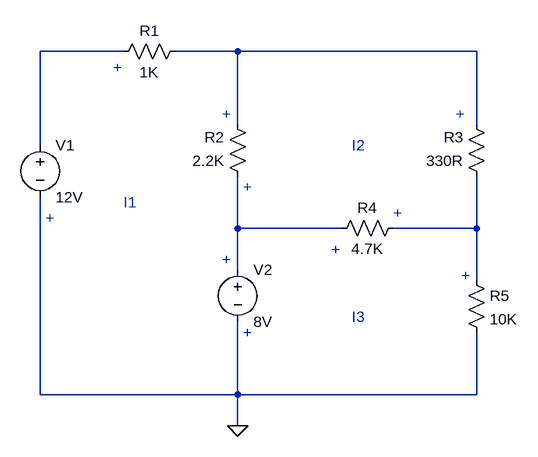
[diagram p0: schematic circuito1.asc]
circuito1.asc, the LTspice schematic file:
Version 4
SHEET 1 880 680
WIRE 64 -192 -64 -192
WIRE 240 -192 144 -192
WIRE 608 -192 240 -192
WIRE 240 -80 240 -192
WIRE 608 -80 608 -192
WIRE -64 -48 -64 -192
WIRE 240 80 240 0
WIRE 400 80 240 80
WIRE 608 80 608 0
WIRE 608 80 480 80
WIRE 240 144 240 80
WIRE 608 160 608 80
WIRE -64 336 -64 32
WIRE 240 336 240 224
WIRE 240 336 -64 336
WIRE 608 336 608 240
WIRE 608 336 240 336
WIRE 240 384 240 336
FLAG 240 384 0
SYMBOL voltage -64 -64 R0
WINDOW 123 0 0 Left 2
WINDOW 39 0 0 Left 2
SYMATTR InstName V1
SYMATTR Value 12V
SYMBOL res 160 -208 R90
WINDOW 0 0 56 VBottom 2
WINDOW 3 32 56 VTop 2
SYMATTR InstName R1
SYMATTR Value 1K
SYMBOL res 256 16 R180
WINDOW 0 36 76 Left 2
WINDOW 3 36 40 Left 2
SYMATTR InstName R2
SYMATTR Value 2.2K
SYMBOL res 624 16 R180
WINDOW 0 36 76 Left 2
WINDOW 3 36 40 Left 2
SYMATTR InstName R3
SYMATTR Value 330R
SYMBOL res 384 96 R270
WINDOW 0 32 56 VTop 2
WINDOW 3 0 56 VBottom 2
SYMATTR InstName R4
SYMATTR Value 4.7K
SYMBOL res 592 144 R0
SYMATTR InstName R5
SYMATTR Value 10K
SYMBOL voltage 240 128 R0
WINDOW 123 0 0 Left 2
WINDOW 39 0 0 Left 2
SYMATTR InstName V2
SYMATTR Value 8V
TEXT 64 40 Left 2 ;I1
TEXT 416 -48 Left 2 ;I2
TEXT 416 216 Left 2 ;I3
TEXT 48 -168 Left 2 ;+
TEXT 216 -96 Left 2 ;+
TEXT 216 128 Left 2 ;+
TEXT -56 64 Left 2 ;+
TEXT 576 -96 Left 2 ;+
TEXT 248 16 Left 2 ;+
TEXT 480 56 Left 2 ;+
TEXT 384 112 Left 2 ;+
TEXT 584 152 Left 2 ;+
TEXT 248 240 Left 2 ;+

The netlist it stands for:
* circuito1.asc
V1 N001 0 12V
R1 N002 N001 1K
R2 N003 N002 2.2K
R3 N004 N002 330R
R4 N003 N004 4.7K
R5 N004 0 10K
V2 N003 0 8V
* I1
* I2
* I3
* +
* +
* +
* +
* +
* +
* +
* +
* +
* +
.backanno
.end